# Altium project DifferentialProbe.PrjPcb
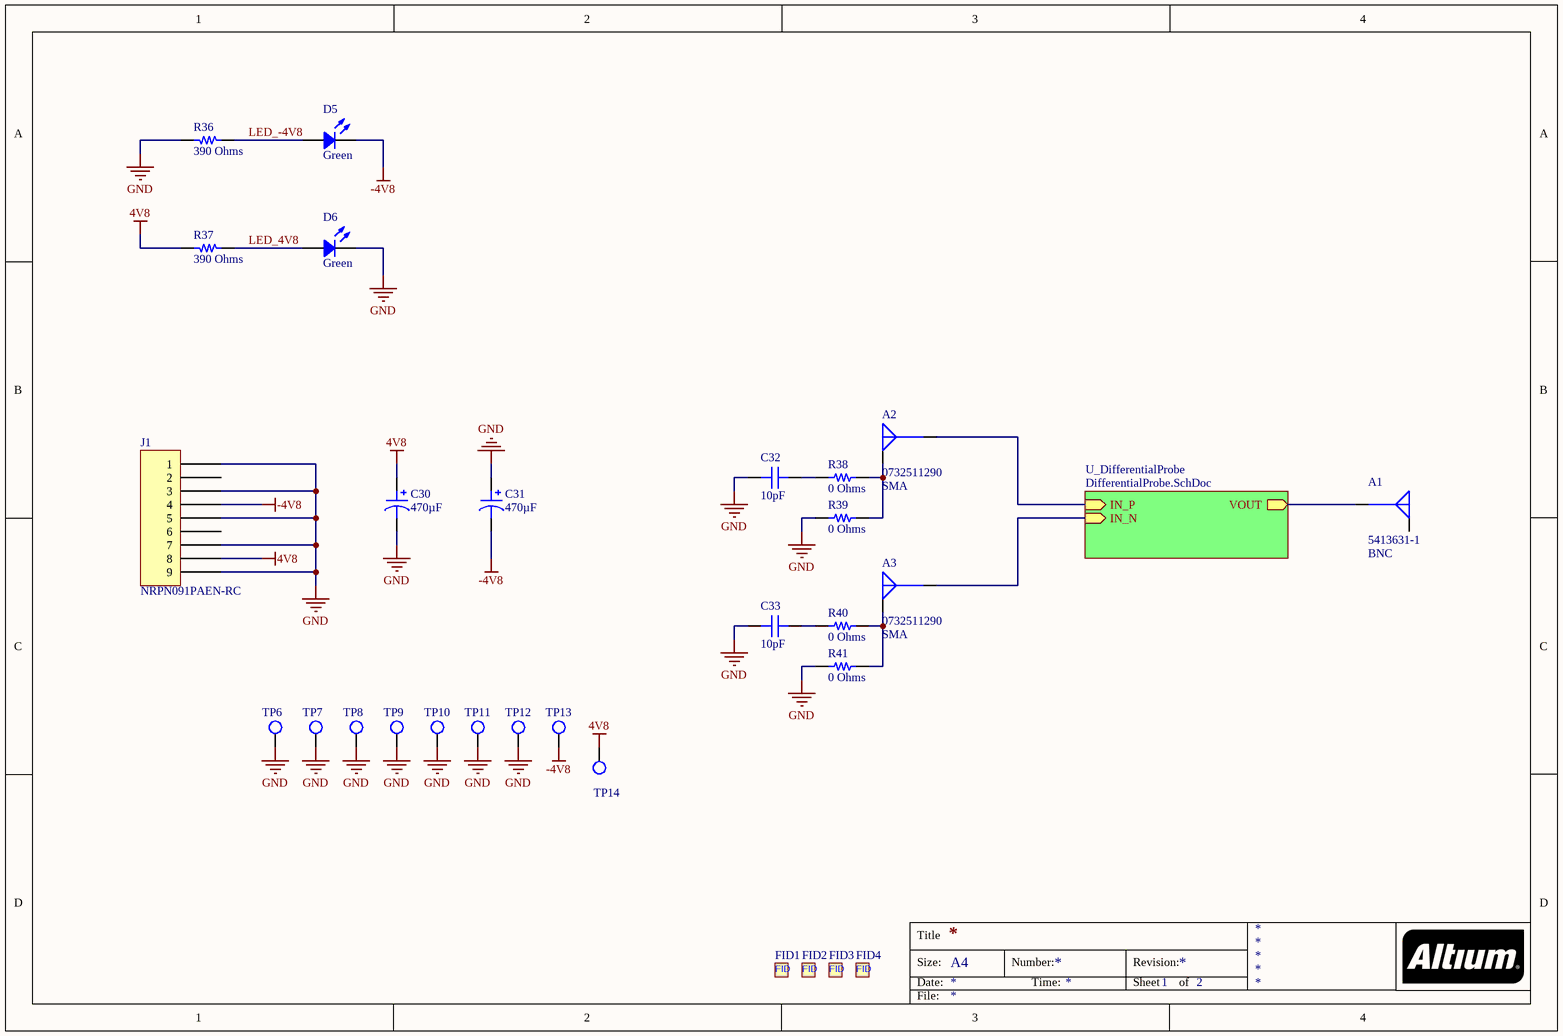
[diagram p0: Probe Connections.SchDoc]
2 sheets, 107 parts. Net scope: hierarchical (ports join the sheet entries above them; power ports are global).
Board file: DifferentialProbe.PcbDoc
Sheets:
  Probe Connections.SchDoc
    U_DifferentialProbe = DifferentialProbe.SchDoc

## Sheet Probe Connections.SchDoc
size A4; SheetNumber: 1; SheetTotal: 2

### Parts
A1  5413631-1  Connector Style: BNC  [TE 5413631-1]
A2  0732511290  Connector Style: SMA  [MOLEX SD-73251-129]
A3  0732511290  Connector Style: SMA  [MOLEX SD-73251-129]
C30  470µF  [CAP POL 2917_7343]
C31  470µF  [CAP POL 2917_7343]
C32  10pF  [CAP 1206_3216 - 1.0MM]
C33  10pF  [CAP 1206_3216 - 1.0MM]
D5  Green  [LED 0805_2012 GREEN]
D6  Green  [LED 0805_2012 GREEN]
FID1  Fiducial  [Fiducial-1mm]  (value not drawn)
FID2  Fiducial  [Fiducial-1mm]  (value not drawn)
FID3  Fiducial  [Fiducial-1mm]  (value not drawn)
FID4  Fiducial  [Fiducial-1mm]  (value not drawn)
J1  NRPN091PAEN-RC  [SULLINS NRPN091PAEN-RC]
R36  390 Ohms  [RES 0805_2012]
R37  390 Ohms  [RES 0805_2012]
R38  0 Ohms  [RES 1206_3216]
R39  0 Ohms  [RES 1206_3216]
R40  0 Ohms  [RES 1206_3216]
R41  0 Ohms  [RES 1206_3216]
TP6  Test Point  [TestPoint-1.5mm]  (value not drawn)  (no BOM)
TP7  Test Point  [TestPoint-1.5mm]  (value not drawn)  (no BOM)
TP8  Test Point  [TestPoint-1.5mm]  (value not drawn)  (no BOM)
TP9  Test Point  [TestPoint-1.5mm]  (value not drawn)  (no BOM)
TP10  Test Point  [TestPoint-1.5mm]  (value not drawn)  (no BOM)
TP11  Test Point  [TestPoint-1.5mm]  (value not drawn)  (no BOM)
TP12  Test Point  [TestPoint-1.5mm]  (value not drawn)  (no BOM)
TP13  Test Point  [TestPoint-1.5mm]  (value not drawn)  (no BOM)
TP14  Test Point  [TestPoint-1.5mm]  (value not drawn)  (no BOM)

### Sub-sheets
U_DifferentialProbe = DifferentialProbe.SchDoc: VOUT (out), IN_P (in), IN_N (in)

### Nets
4V8: C30.1 J1.8 R37.2 TP14.1(TP)
-4V8: C31.2 D5.2 J1.4 TP13.1(TP)
GND: C30.2 C31.1 C32.1 C33.1 D6.2 J1.1 J1.3 J1.5 J1.7 J1.9 R36.2 R39.1 R41.1 TP6.1(TP) TP7.1(TP) TP8.1(TP) TP9.1(TP) TP10.1(TP) TP11.1(TP) TP12.1(TP)
IN_N: A3.S ; sheet U_DifferentialProbe/IN_N
IN_P: A2.S ; sheet U_DifferentialProbe/IN_P
LED_4V8: D6.1 R37.1
LED_-4V8: D5.1 R36.1
VOUT: A1.S ; sheet U_DifferentialProbe/VOUT
NetA2_G: A2.G R38.2 R39.2
NetA3_G: A3.G R40.2 R41.2
NetC32_2: C32.2 R38.1
NetC33_2: C33.2 R40.1

Not connected (* = marked no-connect by the designer): A1 G; J1 2 6

### Notes on the sheet
- Title
- Size:
- Date:
- A4
- Number:
- Time:
- Revision:
- Sheet
- of
- File:
- (in symbol CMP-002-000000-1) FID

### Library data of the parts
A1 = 5413631-1: CONN BNC JACK R/A 50 OHM PCB; Manufacturer: TE Connectivity AMP Connectors; Connector Type: Jack, Female Socket; Contact Termination: Solder; Frequency - Max: 4 GHz; Impedance: 50Ohm; Number of Ports: 1; Part Number: 5413631-1; ComponentLink1Description: Datasheet; ComponentLink1URL: https://www.te.com/commerce/DocumentDelivery/DDEController?Action=srchrtrv&DocNm=1307191_BNC_Connectors&DocType=CS&DocLang=English; ComponentLink2Description: DigiKey Link; ComponentLink2URL: https://www.digikey.com/en/products/detail/te-connectivity-amp-connectors/5413631-1/811168; Fastening Type: Bayonet Lock; Housing Color: Silver; LastUpdated: 29/06/2022 18:00:52; Lifecycle Status: Active; Minimum Order: 1; Mounting Type: Through Hole, Right Angle; Packaging: Bulk; Part Status: Active; Price: 5.77; Series: -; Shield Termination: Solder; Supplier 1: DigiKey; Supplier Part Number 1: A32270-ND
A2 A3 = 0732511290: CONN SMA JACK STR 50OHM EDGE MNT; Manufacturer: Molex; Connector Type: Jack, Female Socket; Contact Termination: Solder; Frequency - Max: 18 GHz; Number of Ports: 1; Part Number: 0732511290; ComponentLink1Description: Datasheet; ComponentLink1URL: https://www.molex.com/pdm_docs/ps/PS-89675-346.pdf; ComponentLink2Description: DigiKey Link; ComponentLink2URL: https://www.digikey.com/en/products/detail/molex/0732511290/3878247; Fastening Type: Threaded; Housing Color: Gold; Impedance: 50Ohm; LastUpdated: 29/06/2022 18:07:55; Lifecycle Status: Active; Minimum Order: 1; Mounting Feature: Bulkhead - Front Side Nut; Mounting Type: Board Edge, End Launch; Panel Mount; Packaging: Tray; Part Status: Active; Price: 4.46; Series: 73251; Shield Termination: Solder; Supplier 1: DigiKey; Supplier Part Number 1: WM9461-ND
C30 C31 = TPSE477K010R0100: CAP TANT 470UF 10% 10V 2917; manufacturer: AVX Corporation; Manufacturer Size Code: E; ESR (Equivalent Series Resistance): 100mOhm; Type: Molded; Part Number: TPSE477K010R0100; Value: 470µF; Capacitance: 470µF; componentlink1description: Datasheet; componentlink1url: http://datasheets.avx.com/TPS.pdf; componentlink2description: DigiKey Link; componentlink2url: http://digikey.com/product-detail/en/avx-corporation/TPSE477K010R0100/478-1807-1-ND/564839; Device Package: 2917 (7343 Metric); Features: General Purpose; Height - Seated (Max): 0.169" (4.30mm); lastupdated: 02/09/2020 01:16:18; Lifecycle Status: Active; Minimum Order: 1; Mounting Type: Surface Mount; Operating Temperature: -55°C ~ 125°C; Package / Case: 2917 (7343 Metric); packaging: TapeAndReel; partid: 1906; Part Status: Active; price: 1.10; series: TPS; Size / Dimension: 0.287" L x 0.169" W (7.30mm x 4.30mm); Supplier 1: DigiKey; Supplier Part Number 1: 478-1807-1-ND; Tolerance: ±10%; Voltage - Rated: 10V
C32 C33 = 1206GA100JAT2A: CAP CER 10PF 2KV C0G/NP0 1206; manufacturer: AVX Corporation; Temperature Coefficient: C0G, NP0; Tolerance: ±5%; Voltage - Rated: 2000V (2kV); Part Number: 1206GA100JAT2A; Value: 10pF; Applications: General Purpose; Capacitance: 10pF; componentlink1description: Datasheet; componentlink1url: http://datasheets.avx.com/AVX-HV_MLCC.pdf; componentlink2description: DigiKey Link; componentlink2url: http://digikey.com/product-detail/en/avx-corporation/1206GA100JAT2A/478-10697-1-ND/7536569; Device Package: 1206 (3216 Metric); Features: High Voltage; lastupdated: 02/09/2020 01:05:04; Lifecycle Status: Active; Minimum Order: 1; Mounting Type: Surface Mount, MLCC; Operating Temperature: -55°C ~ 125°C; Package / Case: 1206 (3216 Metric); packaging: TapeAndReel; partid: 19364; Part Status: Active; price: 0.29; series: -; Size / Dimension: 0.130" L x 0.063" W (3.30mm x 1.60mm); Supplier 1: DigiKey; Supplier Part Number 1: 478-10697-1-ND; Thickness (Max): 0.037" (0.94mm)
D5 D6 = APHCM2012CGCK-F01: LED GREEN CLEAR CHIP SMD; Manufacturer: Kingbright; Configuration: Standard; Current - Test: 20mA; Lens Color: Colorless; Lens Size: 1.30mm x 1.25mm; Lens Style: Rectangle with Flat Top; Millicandela Rating: 50mcd; Viewing Angle: 110°; Voltage - Forward (Vf) (Typ): 2.1V; Wavelength - Dominant: 570nm; Wavelength - Peak: 574nm; Part Number: APHCM2012CGCK-F01; Color: Green; ComponentLink1Description: Datasheet; ComponentLink1URL: http://www.kingbrightusa.com/images/catalog/SPEC/APHCM2012CGCK-F01.pdf; ComponentLink2Description: DigiKey Link; ComponentLink2URL: https://www.digikey.com/en/products/detail/kingbright/APHCM2012CGCK-F01/1747492; Device Package: 0805 (2012 Metric); Height (Max): 0.40mm; LastUpdated: 20/06/2022 12:31:45; Lens Transparency: Clear; Lifecycle Status: Active; Minimum Order: 1; Mounting Type: Surface Mount; Package / Case: 0805 (2012 Metric); Packaging: TapeAndReel; PartId: 241; Part Status: Active; Price: 0.06; Series: -; Size / Dimension: 2.00mm L x 1.25mm W; Supplier 1: DigiKey; Supplier Part Number 1: 754-1094-1-ND; Supplier Device Package: Chip LED; Value: Green
FID1-FID4 = CMP-002-000000-1: Design Item ID: Fiducial; Component Type: Standard; Source: Fiducial.SchLib; Pin Count: 0
J1 = NRPN091PAEN-RC: CONN HEADER VERT 9POS 2MM; Manufacturer: Sullins Connector Solutions; Contact Length - Mating: 0.141" (3.60mm); Contact Length - Post: 0.110" (2.79mm); Current Rating (Amps): 2A; Material Flammability Rating: UL94 V-0; Number of Positions: 9; Number of Positions Loaded: All; Overall Contact Length: 0.331" (8.40mm); Pitch - Mating: 0.079" (2.00mm); Row Spacing - Mating: -40°C ~ 105°C; Shrouding: Unshrouded; Style: Board to Board or Cable; Part Number: NRPN091PAEN-RC; ComponentLink1Description: Datasheet; ComponentLink1URL: https://drawings-pdf.s3.amazonaws.com/10531.pdf; ComponentLink2Description: DigiKey Link; ComponentLink2URL: https://www.digikey.com/en/products/detail/sullins-connector-solutions/NRPN091PAEN-RC/804922; Connector Type: Header; Contact Finish - Mating: Gold; Contact Finish - Post: Gold; Contact Finish Thickness - Mating: Flash; Contact Material: Brass; Contact Shape: Square; Contact Type: Male Pin; Fastening Type: Push-Pull; Insulation Color: Black; Insulation Height: 0.079" (2.00mm); Insulation Material: Polyamide (PA6T), Nylon 6T; LastUpdated: 29/06/2022 18:29:44; Lifecycle Status: Active; Minimum Order: 1; Mounting Type: Through Hole; Number of Rows: 1; Operating Temperature: -40°C ~ 105°C; Packaging: Bulk; PartId: 136; Part Status: Active; Price: 0.27; Series: -; Supplier 1: DigiKey; Supplier Part Number 1: S5800-09-ND; Termination: Solder
R36 R37 = CRG0805F390R: RES SMD 390 OHM 1% 1/8W 0805; Manufacturer: TE Connectivity Passive Product; Power (Watts): 0.125W, 1/8W; Temperature Coefficient: ±100ppm/°C; Part Number: CRG0805F390R; Value: 390 Ohms; ComponentLink1Description: Datasheet; ComponentLink1URL: https://www.te.com/commerce/DocumentDelivery/DDEController?Action=srchrtrv&DocNm=1773204&DocType=DS&DocLang=English; ComponentLink2Description: DigiKey Link; ComponentLink2URL: https://www.digikey.com/en/products/detail/te-connectivity-passive-product/CRG0805F390R/2380897; Composition: Thick Film; Device Package: 0805 (2012 Metric); Height - Seated (Max): 0.026" (0.65mm); LastUpdated: 20/06/2022 12:21:16; Lifecycle Status: Active; Minimum Order: 1; Number of Terminations: 2; Operating Temperature: -55°C ~ 155°C; Package / Case: 0805 (2012 Metric); Packaging: TapeAndReel; PartId: 46128; Part Status: Active; Price: 0.01; Resistance: 390 Ohms; Series: CRG, Neohm; Size / Dimension: 0.079" L x 0.049" W (2.00mm x 1.25mm); Supplier 1: DigiKey; Supplier Part Number 1: A126365CT-ND; Supplier Device Package: 0805; Tolerance: ±1%
R38-R41 = RC1206JR-100RL: RES 0 OHM JUMPER 1/4W 1206; Manufacturer: Yageo; Power (Watts): 0.25W, 1/4W; Part Number: RC1206JR-100RL; ComponentLink1Description: Datasheet; ComponentLink1URL: https://www.yageo.com/upload/media/product/productsearch/datasheet/rchip/PYu-RC_Group_51_RoHS_L_11.pdf; ComponentLink2Description: DigiKey Link; ComponentLink2URL: https://www.digikey.com/en/products/detail/yageo/RC1206JR-100RL/13694179; Composition: Thick Film; Device Package: 1206 (3216 Metric); Features: Moisture Resistant; Height - Seated (Max): 0.026" (0.65mm); LastUpdated: 29/06/2022 14:19:15; Lifecycle Status: Active; Minimum Order: 1; Number of Terminations: 2; Operating Temperature: -55°C ~ 155°C; Package / Case: 1206 (3216 Metric); Packaging: TapeAndReel; PartId: 58659; Part Status: Active; Price: 0.01; Resistance: 0 Ohms; Series: RC_L; Size / Dimension: 0.122" L x 0.063" W (3.10mm x 1.60mm); Supplier 1: DigiKey; Supplier Part Number 1: 13-RC1206JR-100RLCT-ND; Supplier Device Package: 1206; Tolerance: Jumper; Value: 0 Ohms
TP6-TP14 = CMP-003-000000-1: Component Type: Standard (No BOM); Source: Test Point.SchLib; Design Item ID: Test Point; Pin Count: 1

## Sheet DifferentialProbe.SchDoc: Probe
size 420 x 297 mm; SheetNumber: 2; SheetTotal: 2
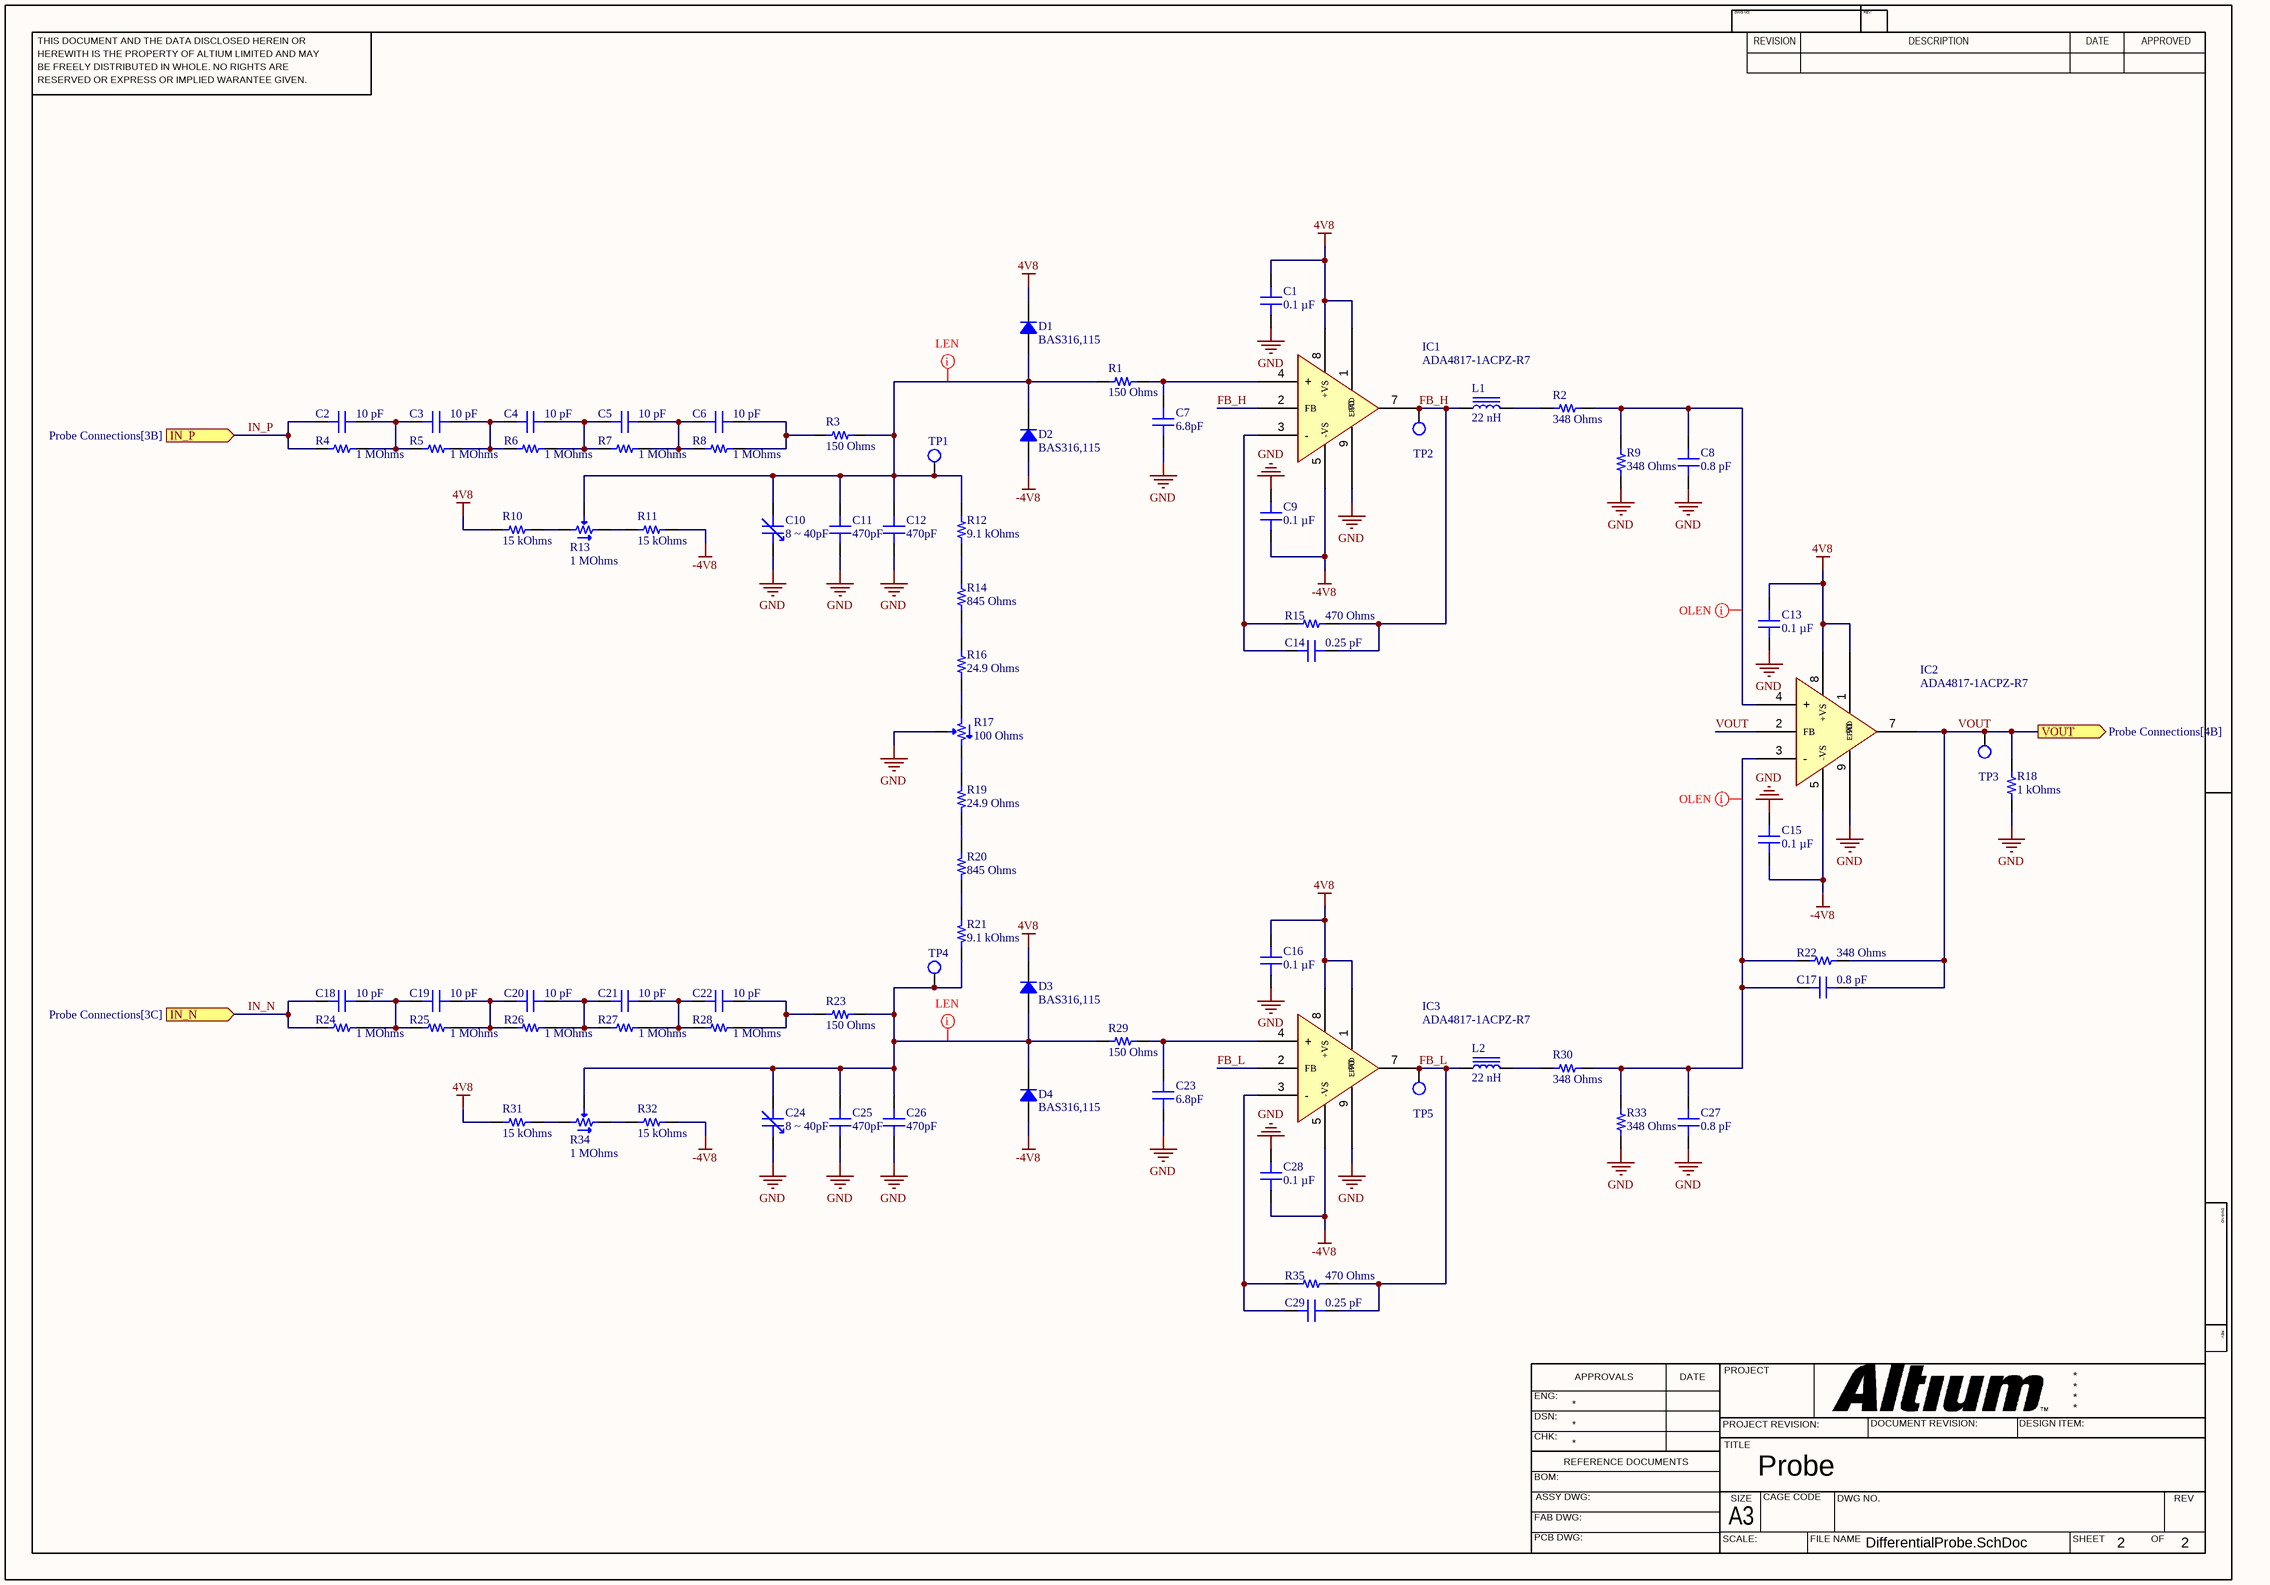
[diagram p1: DifferentialProbe.SchDoc]

### Parts
C1  0.1 µF  [CAP 0402_1005]
C2  10 pF  [CAP 1206_3216 - 0.8MM]
C3  10 pF  [CAP 1206_3216 - 0.8MM]
C4  10 pF  [CAP 1206_3216 - 0.8MM]
C5  10 pF  [CAP 1206_3216 - 0.8MM]
C6  10 pF  [CAP 1206_3216 - 0.8MM]
C7  6.8pF  [CAP 0402_1005]
C8  0.8 pF  [CAP 0402_1005]
C9  0.1 µF  [CAP 0402_1005]
C10  Capacitance Range: 8 ~ 40pF  [KNOWLES JZ]  (hidden comment: JZ400)
C11  470pF  [CAP 0402_1005]
C12  470pF  [CAP 0402_1005]
C13  0.1 µF  [CAP 0402_1005]
C14  0.25 pF  [CAP 0402_1005]
C15  0.1 µF  [CAP 0402_1005]
C16  0.1 µF  [CAP 0402_1005]
C17  0.8 pF  [CAP 0402_1005]
C18  10 pF  [CAP 1206_3216 - 0.8MM]
C19  10 pF  [CAP 1206_3216 - 0.8MM]
C20  10 pF  [CAP 1206_3216 - 0.8MM]
C21  10 pF  [CAP 1206_3216 - 0.8MM]
C22  10 pF  [CAP 1206_3216 - 0.8MM]
C23  6.8pF  [CAP 0402_1005]
C24  Capacitance Range: 8 ~ 40pF  [KNOWLES JZ]  (hidden comment: JZ400)
C25  470pF  [CAP 0402_1005]
C26  470pF  [CAP 0402_1005]
C27  0.8 pF  [CAP 0402_1005]
C28  0.1 µF  [CAP 0402_1005]
C29  0.25 pF  [CAP 0402_1005]
D1  BAS316,115  [SOD323]
D2  BAS316,115  [SOD323]
D3  BAS316,115  [SOD323]
D4  BAS316,115  [SOD323]
IC1  ADA4817-1ACPZ-R7  [AD LFCSP-8 3x3MM CP-8-5]
IC2  ADA4817-1ACPZ-R7  [AD LFCSP-8 3x3MM CP-8-5]
IC3  ADA4817-1ACPZ-R7  [AD LFCSP-8 3x3MM CP-8-5]
L1  22 nH  [IND 0402_1005 RF WW]
L2  22 nH  [IND 0402_1005 RF WW]
R1  150 Ohms  [RES 0402_1005]
R2  348 Ohms  [RES 0402_1005]
R3  150 Ohms  [RES 0402_1005]
R4  1 MOhms  [RES 1206_3216]
R5  1 MOhms  [RES 1206_3216]
R6  1 MOhms  [RES 1206_3216]
R7  1 MOhms  [RES 1206_3216]
R8  1 MOhms  [RES 1206_3216]
R9  348 Ohms  [RES 0402_1005]
R10  15 kOhms  [RES 0402_1005]
R11  15 kOhms  [RES 0402_1005]
R12  9.1 kOhms  [RES 0402_1005]
R13  1 MOhms  [BOURNS TRIMPOT 3386P-1]
R14  845 Ohms  [RES 0402_1005]
R15  470 Ohms  [RES 0402_1005]
R16  24.9 Ohms  [RES 0402_1005]
R17  100 Ohms  [BOURNS TRIMPOT 3386P-1]
R18  1 kOhms  [RES 0402_1005]
R19  24.9 Ohms  [RES 0402_1005]
R20  845 Ohms  [RES 0402_1005]
R21  9.1 kOhms  [RES 0402_1005]
R22  348 Ohms  [RES 0402_1005]
R23  150 Ohms  [RES 0402_1005]
R24  1 MOhms  [RES 1206_3216]
R25  1 MOhms  [RES 1206_3216]
R26  1 MOhms  [RES 1206_3216]
R27  1 MOhms  [RES 1206_3216]
R28  1 MOhms  [RES 1206_3216]
R29  150 Ohms  [RES 0402_1005]
R30  348 Ohms  [RES 0402_1005]
R31  15 kOhms  [RES 0402_1005]
R32  15 kOhms  [RES 0402_1005]
R33  348 Ohms  [RES 0402_1005]
R34  1 MOhms  [BOURNS TRIMPOT 3386P-1]
R35  470 Ohms  [RES 0402_1005]
TP1  Test Point  [TestPoint-1.5mm]  (value not drawn)  (no BOM)
TP2  Test Point  [TestPoint-1.5mm]  (value not drawn)  (no BOM)
TP3  Test Point  [TestPoint-1.5mm]  (value not drawn)  (no BOM)
TP4  Test Point  [TestPoint-1.5mm]  (value not drawn)  (no BOM)
TP5  Test Point  [TestPoint-1.5mm]  (value not drawn)  (no BOM)

### Ports
IN_N (in, see Probe Connections[3C]), IN_P (in, see Probe Connections[3B]), VOUT (out, see Probe Connections[4B])

### Nets
4V8: C1.2 C13.2 C16.2 D1.2 D3.2 IC1.1(~{PD}) IC1.8(+VS) IC2.1(~{PD}) IC2.8(+VS) IC3.1(~{PD}) IC3.8(+VS) R10.1 R31.1
-4V8: C9.1 C15.1 C28.1 D2.1 D4.1 IC1.5(-VS) IC2.5(-VS) IC3.5(-VS) R11.2 R32.2
GND: C1.1 C7.1 C8.2 C9.2 C10.2 C11.1 C12.1 C13.1 C15.2 C16.1 C23.1 C24.2 C25.1 C26.1 C27.2 C28.2 IC1.9(EPAD) IC2.9(EPAD) IC3.9(EPAD) R9.2 R17.2 R18.1 R33.2
FB_H: C14.2 IC1.2(FB) IC1.7(OUT) L1.1 R15.2 TP2.1(TP)
FB_L: C29.2 IC3.2(FB) IC3.7(OUT) L2.1 R35.2 TP5.1(TP)
IN_N: C18.1 R24.1 ; port IN_N
IN_P: C2.1 R4.1 ; port IN_P
VOUT: C17.2 IC2.2(FB) IC2.7(OUT) R18.2 R22.2 TP3.1(TP) ; port VOUT
NetC2_2: C2.2 C3.1 R4.2 R5.1
NetC3_2: C3.2 C4.1 R5.2 R6.1
NetC4_2: C4.2 C5.1 R6.2 R7.1
NetC5_2: C5.2 C6.1 R7.2 R8.1
NetC6_2: C6.2 R3.1 R8.2
NetC7_2: C7.2 IC1.4(+) R1.2
NetC8_1: C8.1 IC2.4(+) R2.2 R9.1
NetC10_1: C10.1 C11.2 C12.2 D1.1 D2.2 R1.1 R3.2 R12.2 R13.2 TP1.1(TP)
NetC14_1: C14.1 IC1.3(-) R15.1
NetC17_1: C17.1 C27.1 IC2.3(-) R22.1 R30.2 R33.1
NetC18_2: C18.2 C19.1 R24.2 R25.1
NetC19_2: C19.2 C20.1 R25.2 R26.1
NetC20_2: C20.2 C21.1 R26.2 R27.1
NetC21_2: C21.2 C22.1 R27.2 R28.1
NetC22_2: C22.2 R23.1 R28.2
NetC23_2: C23.2 IC3.4(+) R29.2
NetC24_1: C24.1 C25.2 C26.2 D3.1 D4.2 R21.2 R23.2 R29.1 R34.2 TP4.1(TP)
NetC29_1: C29.1 IC3.3(-) R35.1
NetL1_2: L1.2 R2.1
NetL2_2: L2.2 R30.1
NetR10_2: R10.2 R13.1
NetR11_1: R11.1 R13.3
NetR12_1: R12.1 R14.2
NetR14_1: R14.1 R16.2
NetR16_1: R16.1 R17.1
NetR17_3: R17.3 R19.1
NetR19_2: R19.2 R20.1
NetR20_2: R20.2 R21.1
NetR31_2: R31.2 R34.1
NetR32_1: R32.1 R34.3

### Layout directives
net class LengthMatch: NetC10_1, NetC24_1
net class OutMatch: NetC8_1, NetC17_1

### Notes on the sheet
- THIS DOCUMENT AND THE DATA DISCLOSED HEREIN OR
- HEREWITH IS THE PROPERTY OF ALTIUM LIMITED AND MAY
- DWG NO:
- REVISION
- REV:
- DESCRIPTION
- DATE
- APPROVED
- BE FREELY DISTRIBUTED IN WHOLE. NO RIGHTS ARE
- RESERVED OR EXPRESS OR IMPLIED WARANTEE GIVEN.
- ENG:
- APPROVALS
- PROJECT
- DSN:
- CHK:
- REFERENCE DOCUMENTS
- PROJECT REVISION:
- TITLE
- DOCUMENT REVISION:
- DESIGN ITEM:
- BOM:
- FAB DWG:
- PCB DWG:
- ASSY DWG:
- SCALE:
- A3
- SIZE
- CAGE CODE
- FILE NAME
- DWG NO.
- SHEET
- OF
- REV

### Library data of the parts
C1 C9 C13 C15 C16 C28 = 0402B104K100CT: CAP CER 0.1UF 10V X7R 0402; manufacturer: Walsin Technology Corporation; Tolerance: ±10%; Part Number: 0402B104K100CT; Value: 0.1 µF; Applications: General Purpose; Capacitance: 0.1 µF; componentlink1description: Datasheet; componentlink1url: http://www.passivecomponent.com/wp-content/uploads/2018/10/MLCC.pdf; componentlink2description: DigiKey Link; componentlink2url: https://www.digikey.com/en/products/detail/walsin-technology-corporation/0402B104K100CT/6707533; Device Package: 0402 (1005 Metric); lastupdated: 28/06/2022 16:55:03; Lifecycle Status: Active; Minimum Order: 1; Mounting Type: Surface Mount, MLCC; Operating Temperature: -55°C ~ 125°C; Package / Case: 0402 (1005 Metric); packaging: TapeAndReel; partid: 38949; Part Status: Active; price: 0.01; series: -; Size / Dimension: 0.039" L x 0.020" W (1.00mm x 0.50mm); Supplier 1: DigiKey; Supplier Part Number 1: 1292-1629-1-ND; Temperature Coefficient: X7R; Thickness (Max): 0.022" (0.55mm); Voltage - Rated: 10V
C2-C6 C18-C22 = CC1206JRNPOBBN100: CAP CER 10PF 500V C0G/NPO 1206; manufacturer: Yageo; Temperature Coefficient: C0G, NP0; Tolerance: ±5%; Part Number: CC1206JRNPOBBN100; Value: 10 pF; Applications: General Purpose; Capacitance: 10 pF; componentlink1description: Datasheet; componentlink1url: http://www.yageo.com/documents/recent/UPY-NP0X7R_MV_100-to-630V_21.pdf; componentlink2description: DigiKey Link; componentlink2url: https://www.digikey.com/en/products/detail/yageo/CC1206JRNPOBBN100/5884499; Device Package: 1206 (3216 Metric); lastupdated: 27/06/2022 11:07:55; Lifecycle Status: Active; Minimum Order: 1; Mounting Type: Surface Mount, MLCC; Operating Temperature: -55°C ~ 125°C; Package / Case: 1206 (3216 Metric); packaging: TapeAndReel; partid: 18815; Part Status: Active; price: 0.04; series: CC; Size / Dimension: 0.126" L x 0.063" W (3.20mm x 1.60mm); Supplier 1: DigiKey; Supplier Part Number 1: 311-4431-1-ND; Thickness (Max): 0.028" (0.70mm); Voltage - Rated: 500V
C7 C23 = 04025U6R8BAT2A: CAP CER 6.8PF 50V NP0 0402; manufacturer: AVX Corporation; Temperature Coefficient: C0G, NP0; Tolerance: ±0.1pF; Part Number: 04025U6R8BAT2A; Value: 6.8pF; Applications: RF, Microwave, High Frequency; Capacitance: 6.8pF; componentlink1description: Datasheet; componentlink1url: http://datasheets.avx.com/U-Series.pdf; componentlink2description: DigiKey Link; componentlink2url: http://digikey.com/product-detail/en/avx-corporation/04025U6R8BAT2A/478-10165-1-ND/6797183; Device Package: 0402 (1005 Metric); Features: Ultra Low ESR; lastupdated: 08/02/2022 12:26:50; Lifecycle Status: Active; Minimum Order: 1; Mounting Type: Surface Mount, MLCC; Operating Temperature: -55°C ~ 125°C; Package / Case: 0402 (1005 Metric); packaging: TapeAndReel; partid: 6872; Part Status: Active; price: 0.03; series: U; Size / Dimension: 0.039" L x 0.020" W (1.00mm x 0.50mm); Supplier 1: DigiKey; Supplier Part Number 1: 478-10165-1-ND; Thickness (Max): 0.022" (0.55mm); Voltage - Rated: 50V
C8 C27 = CBR04C808C5GAC: CAP CER 0.8PF 50V C0G/NP0 0402; manufacturer: KEMET; Temperature Coefficient: C0G, NP0; Tolerance: ±0.25pF; Part Number: CBR04C808C5GAC; Value: 0.8 pF; Applications: RF, Microwave, High Frequency; Capacitance: 0.8 pF; componentlink1description: Datasheet; componentlink1url: https://api.kemet.com/component-edge/download/datasheet/CBR04C808C5GAC.pdf; componentlink2description: DigiKey Link; componentlink2url: https://www.digikey.com/en/products/detail/kemet/CBR04C808C5GAC/2732303; Device Package: 0402 (1005 Metric); Features: High Q, Low Loss, Ultra Low ESR; lastupdated: 28/06/2022 16:55:23; Lifecycle Status: Active; Minimum Order: 1; Mounting Type: Surface Mount, MLCC; Operating Temperature: -55°C ~ 125°C; Package / Case: 0402 (1005 Metric); packaging: TapeAndReel; partid: 39017; Part Status: Active; price: 0.01; series: CBR-SMD RF C0G; Size / Dimension: 0.039" L x 0.020" W (1.00mm x 0.50mm); Supplier 1: DigiKey; Supplier Part Number 1: 399-6160-1-ND; Thickness (Max): 0.022" (0.55mm); Voltage - Rated: 50V
C10 C24 = JZ400: CAP TRIMMER 8-40PF 125V SMD; Manufacturer: Knowles Voltronics; Adjustment Type: Top; Dielectric Material: Ceramic; Q @ Freq: 1500 @ 1MHz; Part Number: JZ400; ComponentLink1Description: Datasheet; ComponentLink1URL: https://www.knowlescapacitors.com/getattachment/4e3ef37f-1910-4b01-89e4-302e57c70f90/JZ-Series.aspx; ComponentLink2Description: DigiKey Link; ComponentLink2URL: https://www.digikey.com/en/products/detail/knowles-voltronics/JZ400/6021623; Features: General Purpose; Height - Seated (Max): 0.057" (1.45mm); LastUpdated: 29/06/2022 15:30:24; Lifecycle Status: Active; Minimum Order: 1; Mounting Type: Surface Mount; Operating Temperature: -40°C ~ 85°C; Packaging: TapeAndReel; Part Status: Active; Price: 1.51; Series: JZ; Size / Dimension: 0.177" L x 0.126" W (4.50mm x 3.20mm); Supplier 1: DigiKey; Supplier Part Number 1: 1674-1006-1-ND
C11 C12 C25 C26 = 04025A471JAT2A: CAP CER 470PF 50V C0G/NP0 0402; manufacturer: AVX Corporation; Temperature Coefficient: C0G, NP0; Tolerance: ±5%; Part Number: 04025A471JAT2A; Value: 470pF; Applications: General Purpose; Capacitance: 470pF; componentlink1description: Datasheet; componentlink1url: http://datasheets.avx.com/C0GNP0-Dielectric.pdf; componentlink2description: DigiKey Link; componentlink2url: http://digikey.com/product-detail/en/avx-corporation/04025A471JAT2A/478-7880-1-ND/3881503; Device Package: 0402 (1005 Metric); lastupdated: 08/02/2022 12:26:47; Lifecycle Status: Active; Minimum Order: 1; Mounting Type: Surface Mount, MLCC; Operating Temperature: -55°C ~ 125°C; Package / Case: 0402 (1005 Metric); packaging: TapeAndReel; partid: 8853; Part Status: Active; price: 0.01; series: -; Size / Dimension: 0.039" L x 0.020" W (1.00mm x 0.50mm); Supplier 1: DigiKey; Supplier Part Number 1: 478-7880-1-ND; Thickness (Max): 0.022" (0.55mm); Voltage - Rated: 50V
C14 C29 = GCQ1555C1HR25BB01D: CAP CER 0.25PF 50V C0G/NP0 0402; manufacturer: Murata Electronics; Temperature Coefficient: C0G, NP0; Tolerance: ±0.1pF; Part Number: GCQ1555C1HR25BB01D; Value: 0.25 pF; Applications: RF, Microwave, High Frequency, Automotive; Capacitance: 0.25 pF; componentlink1description: Datasheet; componentlink1url: https://search.murata.co.jp/Ceramy/image/img/A01X/G101/ENG/GCQ1555C1HR25BB01-01.pdf; componentlink2description: DigiKey Link; componentlink2url: https://www.digikey.com/en/products/detail/murata-electronics/GCQ1555C1HR25BB01D/7803249; Device Package: 0402 (1005 Metric); lastupdated: 28/06/2022 16:54:55; Lifecycle Status: Active; Minimum Order: 1; Mounting Type: Surface Mount, MLCC; Operating Temperature: -55°C ~ 125°C; Package / Case: 0402 (1005 Metric); packaging: TapeAndReel; partid: 13204; Part Status: Active; price: 0.05; Ratings: AEC-Q200; series: GCQ; Size / Dimension: 0.039" L x 0.020" W (1.00mm x 0.50mm); Supplier 1: DigiKey; Supplier Part Number 1: 490-17543-1-ND; Thickness (Max): 0.022" (0.55mm); Voltage - Rated: 50V
C17 = CC0402BRNPO9BNR80: CAP CER 0.8PF 50V C0G/NPO 0402; manufacturer: Yageo; Temperature Coefficient: C0G, NP0; Tolerance: ±0.1pF; Part Number: CC0402BRNPO9BNR80; Value: 0.8 pF; Applications: General Purpose; Capacitance: 0.8 pF; componentlink1description: Datasheet; componentlink1url: https://www.yageo.com/upload/media/product/productsearch/datasheet/mlcc/UPY-GP_NP0_16V-to-50V_17.pdf; componentlink2description: DigiKey Link; componentlink2url: https://www.digikey.com/en/products/detail/yageo/CC0402BRNPO9BNR80/5883200; Device Package: 0402 (1005 Metric); lastupdated: 28/06/2022 16:55:12; Lifecycle Status: Active; Minimum Order: 1; Mounting Type: Surface Mount, MLCC; Operating Temperature: -55°C ~ 125°C; Package / Case: 0402 (1005 Metric); packaging: TapeAndReel; partid: 8101; Part Status: Active; price: 0.01; series: CC; Size / Dimension: 0.039" L x 0.020" W (1.00mm x 0.50mm); Supplier 1: DigiKey; Supplier Part Number 1: 311-3711-1-ND; Thickness (Max): 0.022" (0.55mm); Voltage - Rated: 50V
D1-D4 = BAS316,115: DIODE GEN PURP 100V 250MA SOD323; Manufacturer: Nexperia USA Inc.; Capacitance @ Vr, F: 1.5pF @ 0V, 1MHz; Current - Average Rectified (Io): 250mA (DC); Current - Reverse Leakage @ Vr: 500 nA @ 80 V; Diode Type: Standard; Reverse Recovery Time (trr): 4 ns; Speed: Fast Recovery =< 500ns, > 200mA (Io); Voltage - Forward (Vf) (Max) @ If: 1.25 V @ 150 mA; Part Number: BAS316,115; ComponentLink1Description: Datasheet; ComponentLink1URL: https://assets.nexperia.com/documents/data-sheet/BAS16_SER.pdf; ComponentLink2Description: DigiKey Link; ComponentLink2URL: https://www.digikey.com/en/products/detail/nexperia-usa-inc/BAS316-115/1232076; LastUpdated: 30/06/2022 23:02:29; Lifecycle Status: Active; Minimum Order: 1; Mounting Type: Surface Mount; Operating Temperature - Junction: 150°C (Max); Package / Case: SC-76, SOD-323; Packaging: TapeAndReel; PartId: 3004; Part Status: Active; Price: 0.02; Series: Automotive, AEC-Q101, BAS16; Supplier 1: DigiKey; Supplier Part Number 1: 1727-4309-1-ND; Supplier Device Package: SOD-323; Voltage - DC Reverse (Vr) (Max): 100 V
IC1-IC3 = ADA4817-1ACPZ-R7: IC OPAMP VFB 1 CIRCUIT 8LFCSP; Manufacturer: Analog Devices Inc.; -3db Bandwidth: 1.05 GHz; Amplifier Type: Voltage Feedback; Current - Input Bias: 2 pA; Current - Output / Channel: 40 mA; Current - Supply: 19mA; Gain Bandwidth Product: 410 MHz; Number of Circuits: 1; Slew Rate: 870V/µs; Voltage - Input Offset: 400 µV; Voltage - Supply, Single/Dual (±): 5V ~ 10V, ±2.5V ~ 5V; Part Number: ADA4817-1ACPZ-R7; ComponentLink1Description: Datasheet; ComponentLink1URL: https://www.analog.com/media/en/technical-documentation/data-sheets/ADA4817-1_4817-2.pdf; ComponentLink2Description: DigiKey Link; ComponentLink2URL: https://www.digikey.com/en/products/detail/analog-devices-inc/ADA4817-1ACPZ-R7/1979396; LastUpdated: 28/06/2022 17:22:42; Lifecycle Status: Active; Minimum Order: 1; Mounting Type: Surface Mount; Operating Temperature: -40°C ~ 105°C; Package / Case: 8-WFDFN Exposed Pad, CSP; Packaging: TapeAndReel; PartId: 46; Part Status: Active; Price: 4.88; Series: FastFET™; Supplier 1: DigiKey; Supplier Part Number 1: 505-ADA4817-1ACPZ-R7CT-ND; Supplier Device Package: 8-LFCSP (3x3)
L1 L2 = LQW15AN22NG80D: FIXED IND 22NH 780MA 202MOHM SMD; Manufacturer: Murata Electronics; DC Resistance (DCR): 202mOhm Max; Frequency - Self Resonant: 4.5GHz; Inductance Frequency - Test: 100 MHz; Material - Core: Non-Magnetic; Q @ Freq: 30 @ 250MHz; Shielding: Unshielded; Tolerance: ±2%; Type: Wirewound; Part Number: LQW15AN22NG80D; ComponentLink1Description: Datasheet; ComponentLink1URL: https://search.murata.co.jp/Ceramy/image/img/P02/JELF243A-0100.pdf; ComponentLink2Description: DigiKey Link; ComponentLink2URL: https://www.digikey.com/en/products/detail/murata-electronics/LQW15AN22NG80D/4292341; Current Rating (Amps): 780 mA; Device Package: 0402 (1005 Metric); Height - Seated (Max): 0.024" (0.60mm); Inductance: 22 nH; LastUpdated: 27/06/2022 11:51:12; Lifecycle Status: Active; Minimum Order: 1; Mounting Type: Surface Mount; Operating Temperature: -55°C ~ 125°C; Package / Case: 0402 (1005 Metric); Packaging: TapeAndReel; PartId: 350; Part Status: Active; Price: 0.08; Series: LQW15; Size / Dimension: 0.039" L x 0.024" W (1.00mm x 0.60mm); Supplier 1: DigiKey; Supplier Part Number 1: 490-7628-1-ND; Value: 22 nH
R1 R3 R23 R29 = RG1005P-151-B-T5: RES SMD 150 OHM 0.1% 1/16W 0402; Manufacturer: Susumu; Power (Watts): 0.063W, 1/16W; Temperature Coefficient: ±25ppm/°C; Part Number: RG1005P-151-B-T5; Value: 150 Ohms; ComponentLink1Description: Datasheet; ComponentLink1URL: http://www.susumu.co.jp/common/pdf/n_catalog_partition01_en.pdf; ComponentLink2Description: DigiKey Link; ComponentLink2URL: https://www.digikey.com/en/products/detail/susumu/RG1005P-151-B-T5/968732; Composition: Thin Film; Device Package: 0402 (1005 Metric); Features: Anti-Sulfur, Automotive AEC-Q200; Height - Seated (Max): 0.016" (0.40mm); LastUpdated: 27/06/2022 11:16:36; Lifecycle Status: Active; Minimum Order: 1; Number of Terminations: 2; Operating Temperature: -55°C ~ 155°C; Package / Case: 0402 (1005 Metric); Packaging: TapeAndReel; PartId: 7627; Part Status: Active; Price: 0.06; Ratings: AEC-Q200; Resistance: 150 Ohms; Series: RG; Size / Dimension: 0.039" L x 0.020" W (1.00mm x 0.50mm); Supplier 1: DigiKey; Supplier Part Number 1: RG10P150BCT-ND; Supplier Device Package: 0402; Tolerance: ±0.1%
R2 R9 R22 R30 R33 = RT0402BRD07348RL: RES SMD 348 OHM 0.1% 1/16W 0402; Manufacturer: Yageo; Power (Watts): 0.063W, 1/16W; Temperature Coefficient: ±25ppm/°C; Part Number: RT0402BRD07348RL; Value: 348 Ohms; ComponentLink1Description: Datasheet; ComponentLink1URL: https://www.yageo.com/upload/media/product/productsearch/datasheet/rchip/PYu-RT_1-to-0.01_RoHS_L_11.pdf; ComponentLink2Description: DigiKey Link; ComponentLink2URL: https://www.digikey.com/en/products/detail/yageo/RT0402BRD07348RL/1069221; Composition: Thin Film; Device Package: 0402 (1005 Metric); Height - Seated (Max): 0.014" (0.35mm); LastUpdated: 28/06/2022 17:11:53; Lifecycle Status: Active; Minimum Order: 1; Number of Terminations: 2; Operating Temperature: -55°C ~ 155°C; Package / Case: 0402 (1005 Metric); Packaging: TapeAndReel; PartId: 4531; Part Status: Active; Price: 0.04; Resistance: 348 Ohms; Series: RT; Size / Dimension: 0.039" L x 0.020" W (1.00mm x 0.50mm); Supplier 1: DigiKey; Supplier Part Number 1: YAG4245CT-ND; Supplier Device Package: 0402; Tolerance: ±0.1%
R4-R8 R24-R28 = RNCS1206BKE1M00: RES 1M OHM 0.1% 1/8W 1206; Manufacturer: Stackpole Electronics Inc; Power (Watts): 0.125W, 1/8W; Temperature Coefficient: ±25ppm/°C; Part Number: RNCS1206BKE1M00; ComponentLink1Description: Datasheet; ComponentLink1URL: https://www.seielect.com/catalog/sei-rncs_rnch.pdf; ComponentLink2Description: DigiKey Link; ComponentLink2URL: https://www.digikey.com/en/products/detail/stackpole-electronics-inc/RNCS1206BKE1M00/1801448; Composition: Thin Film; Device Package: 1206 (3216 Metric); Features: Anti-Corrosive, Automotive AEC-Q200, Moisture Resistant; Height - Seated (Max): 0.026" (0.65mm); LastUpdated: 27/06/2022 11:30:14; Lifecycle Status: Active; Minimum Order: 1; Number of Terminations: 2; Operating Temperature: -55°C ~ 155°C; Package / Case: 1206 (3216 Metric); Packaging: TapeAndReel; PartId: 33934; Part Status: Active; Price: 0.09; Ratings: AEC-Q200; Resistance: 1 MOhms; Series: RNCS; Size / Dimension: 0.120" L x 0.061" W (3.05mm x 1.55mm); Supplier 1: DigiKey; Supplier Part Number 1: RNCS1206BKE1M00CT-ND; Supplier Device Package: 1206; Tolerance: ±0.1%; Value: 1 MOhms
R10 R11 R31 R32 = RN73R1ETTP1502B25: RES 15K OHM 0.1% 1/16W 0402; Manufacturer: KOA Speer Electronics, Inc.; Power (Watts): 0.063W, 1/16W; Temperature Coefficient: ±25ppm/°C; Part Number: RN73R1ETTP1502B25; Value: 15 kOhms; ComponentLink1Description: Datasheet; ComponentLink1URL: //media.digikey.com/pdf/Data%20Sheets/KOA%20Speer/RN73R_Type_DS.pdf; ComponentLink2Description: DigiKey Link; ComponentLink2URL: https://www.digikey.com/en/products/detail/koa-speer-electronics-inc/RN73R1ETTP1502B25/9991844; Composition: Thin Film; Device Package: 0402 (1005 Metric); Features: Automotive AEC-Q200, Moisture Resistant; Height - Seated (Max): 0.016" (0.40mm); LastUpdated: 27/06/2022 11:16:46; Lifecycle Status: Active; Minimum Order: 0; Number of Terminations: 2; Operating Temperature: -55°C ~ 155°C; Package / Case: 0402 (1005 Metric); PartId: 5317; Part Status: Active; Price: 0; Ratings: AEC-Q200; Resistance: 15 kOhms; Series: RN73R; Size / Dimension: 0.039" L x 0.020" W (1.00mm x 0.50mm); Supplier 1: DigiKey; Supplier Part Number 1: 2019-RN73R1ETTP1502B25TR-ND; Supplier Device Package: 0402; Tolerance: ±0.1%
R12 R21 = CPF0402B9K1E1: RES SMD 9.1K OHM 0.1% 1/16W 0402; Manufacturer: TE Connectivity Passive Product; Power (Watts): 0.063W, 1/16W; Temperature Coefficient: ±25ppm/°C; Part Number: CPF0402B9K1E1; Value: 9.1 kOhms; ComponentLink1Description: Datasheet; ComponentLink1URL: https://www.te.com/commerce/DocumentDelivery/DDEController?Action=srchrtrv&DocNm=1773200&DocType=DS&DocLang=English; ComponentLink2Description: DigiKey Link; ComponentLink2URL: https://www.digikey.com/en/products/detail/te-connectivity-passive-product/CPF0402B9K1E1/2381827; Composition: Thin Film; Device Package: 0402 (1005 Metric); Height - Seated (Max): 0.014" (0.35mm); LastUpdated: 28/06/2022 17:11:48; Lifecycle Status: Active; Minimum Order: 1; Number of Terminations: 2; Operating Temperature: -55°C ~ 155°C; Package / Case: 0402 (1005 Metric); Packaging: TapeAndReel; PartId: 5611; Part Status: Active; Price: 0.14; Resistance: 9.1 kOhms; Series: CPF, Neohm; Size / Dimension: 0.039" L x 0.020" W (1.00mm x 0.50mm); Supplier 1: DigiKey; Supplier Part Number 1: A103026CT-ND; Supplier Device Package: 0402; Tolerance: ±0.1%
R13 R34 = 3386P-1-105LF: TRIMMER 1M OHM 0.5W PC PIN TOP; Manufacturer: Bourns Inc.; Adjustment Type: Top Adjustment; Number of Turns: 1; Power (Watts): 0.5W, 1/2W; Resistive Material: Cermet; Temperature Coefficient: ±100ppm/°C; Tolerance: ±10%; Part Number: 3386P-1-105LF; ComponentLink1Description: Datasheet; ComponentLink1URL: https://www.bourns.com/docs/Product-Datasheets/3386.pdf; ComponentLink2Description: DigiKey Link; ComponentLink2URL: https://www.digikey.com/en/products/detail/bourns-inc/3386P-1-105LF/1088525; LastUpdated: 27/06/2022 12:04:02; Lifecycle Status: Active; Minimum Order: 1; Mounting Type: Through Hole; Packaging: Tube; PartId: 105; Part Status: Active; Price: 0.72; Resistance: 1 MOhms; Series: Trimpot® 3386 - Sealed; Size / Dimension: Square - 0.375" x 0.375" Face x 0.190" H (9.53mm x 9.53mm x 4.83mm); Supplier 1: DigiKey; Supplier Part Number 1: 3386P-105LF-ND; Termination Style: PC Pins; Value: 1 MOhms
R14 R20 = ERA-2AEB8450X: RES SMD 845 OHM 0.1% 1/16W 0402; Manufacturer: Panasonic Electronic Components; Power (Watts): 0.063W, 1/16W; Temperature Coefficient: ±25ppm/°C; Part Number: ERA-2AEB8450X; Value: 845 Ohms; ComponentLink1Description: Datasheet; ComponentLink1URL: https://industrial.panasonic.com/cdbs/www-data/pdf/RDM0000/AOA0000C307.pdf; ComponentLink2Description: DigiKey Link; ComponentLink2URL: https://www.digikey.com/en/products/detail/panasonic-electronic-components/ERA-2AEB8450X/2026047; Composition: Thin Film; Device Package: 0402 (1005 Metric); Features: Automotive AEC-Q200; Height - Seated (Max): 0.016" (0.40mm); LastUpdated: 28/06/2022 17:11:17; Lifecycle Status: Active; Minimum Order: 1; Number of Terminations: 2; Operating Temperature: -55°C ~ 155°C; Package / Case: 0402 (1005 Metric); Packaging: TapeAndReel; PartId: 14335; Part Status: Active; Price: 0.05; Ratings: AEC-Q200; Resistance: 845 Ohms; Series: ERA-2A; Size / Dimension: 0.039" L x 0.020" W (1.00mm x 0.50mm); Supplier 1: DigiKey; Supplier Part Number 1: P845DCCT-ND; Supplier Device Package: 0402; Tolerance: ±0.1%
R15 R35 = RT0402BRD07470RL: RES SMD 470 OHM 0.1% 1/16W 0402; Manufacturer: Yageo; Power (Watts): 0.063W, 1/16W; Temperature Coefficient: ±25ppm/°C; Part Number: RT0402BRD07470RL; Value: 470 Ohms; ComponentLink1Description: Datasheet; ComponentLink1URL: https://www.yageo.com/upload/media/product/productsearch/datasheet/rchip/PYu-RT_1-to-0.01_RoHS_L_11.pdf; ComponentLink2Description: DigiKey Link; ComponentLink2URL: https://www.digikey.com/en/products/detail/yageo/RT0402BRD07470RL/1069287; Composition: Thin Film; Device Package: 0402 (1005 Metric); Height - Seated (Max): 0.014" (0.35mm); LastUpdated: 28/06/2022 17:11:18; Lifecycle Status: Active; Minimum Order: 1; Number of Terminations: 2; Operating Temperature: -55°C ~ 155°C; Package / Case: 0402 (1005 Metric); Packaging: TapeAndReel; PartId: 13979; Part Status: Active; Price: 0.04; Resistance: 470 Ohms; Series: RT; Size / Dimension: 0.039" L x 0.020" W (1.00mm x 0.50mm); Supplier 1: DigiKey; Supplier Part Number 1: YAG4268CT-ND; Supplier Device Package: 0402; Tolerance: ±0.1%
R16 R19 = RT0402BRD0724R9L: RES SMD 24.9 OHM 0.1% 1/16W 0402; Manufacturer: Yageo; Power (Watts): 0.063W, 1/16W; Temperature Coefficient: ±25ppm/°C; Part Number: RT0402BRD0724R9L; Value: 24.9 Ohms; ComponentLink1Description: Datasheet; ComponentLink1URL: https://www.yageo.com/upload/media/product/productsearch/datasheet/rchip/PYu-RT_1-to-0.01_RoHS_L_11.pdf; ComponentLink2Description: DigiKey Link; ComponentLink2URL: https://www.digikey.com/en/products/detail/yageo/RT0402BRD0724R9L/1069153; Composition: Thin Film; Device Package: 0402 (1005 Metric); Height - Seated (Max): 0.014" (0.35mm); LastUpdated: 28/06/2022 17:10:58; Lifecycle Status: Active; Minimum Order: 1; Number of Terminations: 2; Operating Temperature: -55°C ~ 155°C; Package / Case: 0402 (1005 Metric); Packaging: TapeAndReel; PartId: 19431; Part Status: Active; Price: 0.04; Resistance: 24.9 Ohms; Series: RT; Size / Dimension: 0.039" L x 0.020" W (1.00mm x 0.50mm); Supplier 1: DigiKey; Supplier Part Number 1: YAG4216CT-ND; Supplier Device Package: 0402; Tolerance: ±0.1%
R17 = 3386P-1-101LF: TRIMMER 100 OHM 0.5W PC PIN TOP; Manufacturer: Bourns Inc.; Adjustment Type: Top Adjustment; Number of Turns: 1; Power (Watts): 0.5W, 1/2W; Resistive Material: Cermet; Temperature Coefficient: ±100ppm/°C; Tolerance: ±10%; Part Number: 3386P-1-101LF; ComponentLink1Description: Datasheet; ComponentLink1URL: https://www.bourns.com/docs/Product-Datasheets/3386.pdf; ComponentLink2Description: DigiKey Link; ComponentLink2URL: https://www.digikey.com/en/products/detail/bourns-inc/3386P-1-101LF/1088522; LastUpdated: 27/06/2022 12:04:02; Lifecycle Status: Active; Minimum Order: 1; Mounting Type: Through Hole; Packaging: Tube; PartId: 114; Part Status: Active; Price: 0.72; Resistance: 100 Ohms; Series: Trimpot® 3386 - Sealed; Size / Dimension: Square - 0.375" x 0.375" Face x 0.190" H (9.53mm x 9.53mm x 4.83mm); Supplier 1: DigiKey; Supplier Part Number 1: 3386P-101LF-ND; Termination Style: PC Pins; Value: 100 Ohms
R18 = RMCF0402FT1K00: RES 1K OHM 1% 1/16W 0402; Manufacturer: Stackpole Electronics Inc; Power (Watts): 0.063W, 1/16W; Temperature Coefficient: ±100ppm/°C; Part Number: RMCF0402FT1K00; Value: 1 kOhms; ComponentLink1Description: Datasheet; ComponentLink1URL: https://www.seielect.com/catalog/sei-rmcf_rmcp.pdf; ComponentLink2Description: DigiKey Link; ComponentLink2URL: https://www.digikey.com/en/products/detail/stackpole-electronics-inc/RMCF0402FT1K00/1761754; Composition: Thick Film; Device Package: 0402 (1005 Metric); Features: Automotive AEC-Q200; Height - Seated (Max): 0.016" (0.40mm); LastUpdated: 28/06/2022 17:10:53; Lifecycle Status: Active; Minimum Order: 1; Number of Terminations: 2; Operating Temperature: -55°C ~ 155°C; Package / Case: 0402 (1005 Metric); Packaging: CutTape; PartId: 20544; Part Status: Active; Price: 0.01; Ratings: AEC-Q200; Resistance: 1 kOhms; Series: RMCF; Size / Dimension: 0.039" L x 0.020" W (1.00mm x 0.50mm); Supplier 1: DigiKey; Supplier Part Number 1: RMCF0402FT1K00CT-ND; Supplier Device Package: 0402; Tolerance: ±1%
TP1-TP5 = CMP-003-000000-1: Component Type: Standard (No BOM); Source: Test Point.SchLib; Design Item ID: Test Point; Pin Count: 1

## Nets that join several sheets
4V8: Probe Connections (C30.1 J1.8 R37.2 TP14.1), DifferentialProbe (13 pins)
-4V8: Probe Connections (C31.2 D5.2 J1.4 TP13.1), DifferentialProbe (10 pins)
GND: Probe Connections (20 pins), DifferentialProbe (23 pins)
IN_N: Probe Connections (A3.S), DifferentialProbe (C18.1 R24.1)
IN_P: Probe Connections (A2.S), DifferentialProbe (C2.1 R4.1)
VOUT: Probe Connections (A1.S), DifferentialProbe (6 pins)